# EAGLE design PAM8403 Amplifier Board R1 (EAGLE 9.6.2)
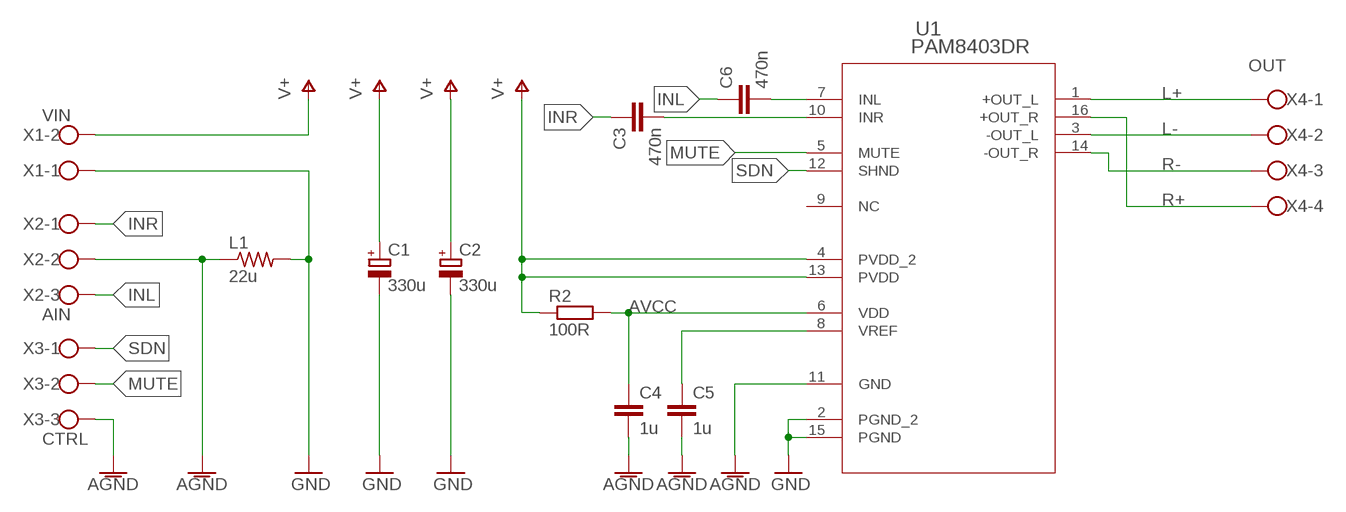
[diagram p0: schematic, sheet 1]

## Parts
C1  330u  CPOL-EUE3.5-8  [E3,5-8]
C2  330u  CPOL-EUE3.5-8  [E3,5-8]
C3  470n  C-EUC1206  [C1206]
C4  1u  C-EUC1206  [C1206]
C5  1u  C-EUC1206  [C1206]
C6  470n  C-EUC1206  [C1206]
L1  22u  R-US_R0805  [R0805]
R2  100R  R-EU_R0603  [R0603]
U1  PAM8403DR  [SOIC_8403DR_DIO]
X1  VIN  W237-102  [W237-102]
X2  AIN  W237-103  [W237-103]
X3  CTRL  W237-103  [W237-103]
X4  OUT  W237-4  [W237-4]

## Nets
AGND: C4.2 C5.2 L1.1 U1.11(GND) X2.2 X3.3
AVCC: C4.1 R2.2 U1.6(VDD)
GND: C1.- C2.- L1.2 U1.2(PGND_2) U1.15(PGND) X1.1
INL: C6.1 X2.3
INR: C3.1 X2.1
L+: U1.1(+OUT_L) X4.1
L-: U1.3(-OUT_L) X4.2
MUTE: U1.5(MUTE) X3.2
N$1: C3.2 U1.10(INR)
N$2: C6.2 U1.7(INL)
N$3: C5.1 U1.8(VREF)
R+: U1.16(+OUT_R) X4.4
R-: U1.14(-OUT_R) X4.3
SDN: U1.12(SHND) X3.1
V+: C1.+ C2.+ R2.1 U1.4(PVDD_2) U1.13(PVDD) X1.2
Unconnected: U1.9(NC)

## Library data of the parts
C1 C2 = rcl:CPOL-EU: POLARIZED CAPACITOR, European symbol; SPICEPREFIX: C
C3-C6 = rcl:C-EU: CAPACITOR, European symbol; SPICEPREFIX: C
L1 = rcl:R-US_: RESISTOR, American symbol; SPICEPREFIX: R
R2 = rcl:R-EU_: RESISTOR, European symbol; SPICEPREFIX: R
U1 = user:PAM8403DR; COPYRIGHT: Copyright (C) 2023 Ultra Librarian. All rights reserved.; MANUFACTURER_PART_NUMBER: PAM8403DR; MFR_NAME: Diodes Inc
X1 = con-wago-500:W237-102: WAGO SCREW CLAMP; MPN: 237-102; OC_FARNELL: unknown; OC_NEWARK: 70K9898
X2 X3 = con-wago-500:W237-103: WAGO SCREW CLAMP; MPN: 237-103; OC_FARNELL: unknown; OC_NEWARK: 18M7116
X4 = con-wago-500:W237-4: WAGO SCREW CLAMP; OC_FARNELL: unknown; OC_NEWARK: unknown

## Board
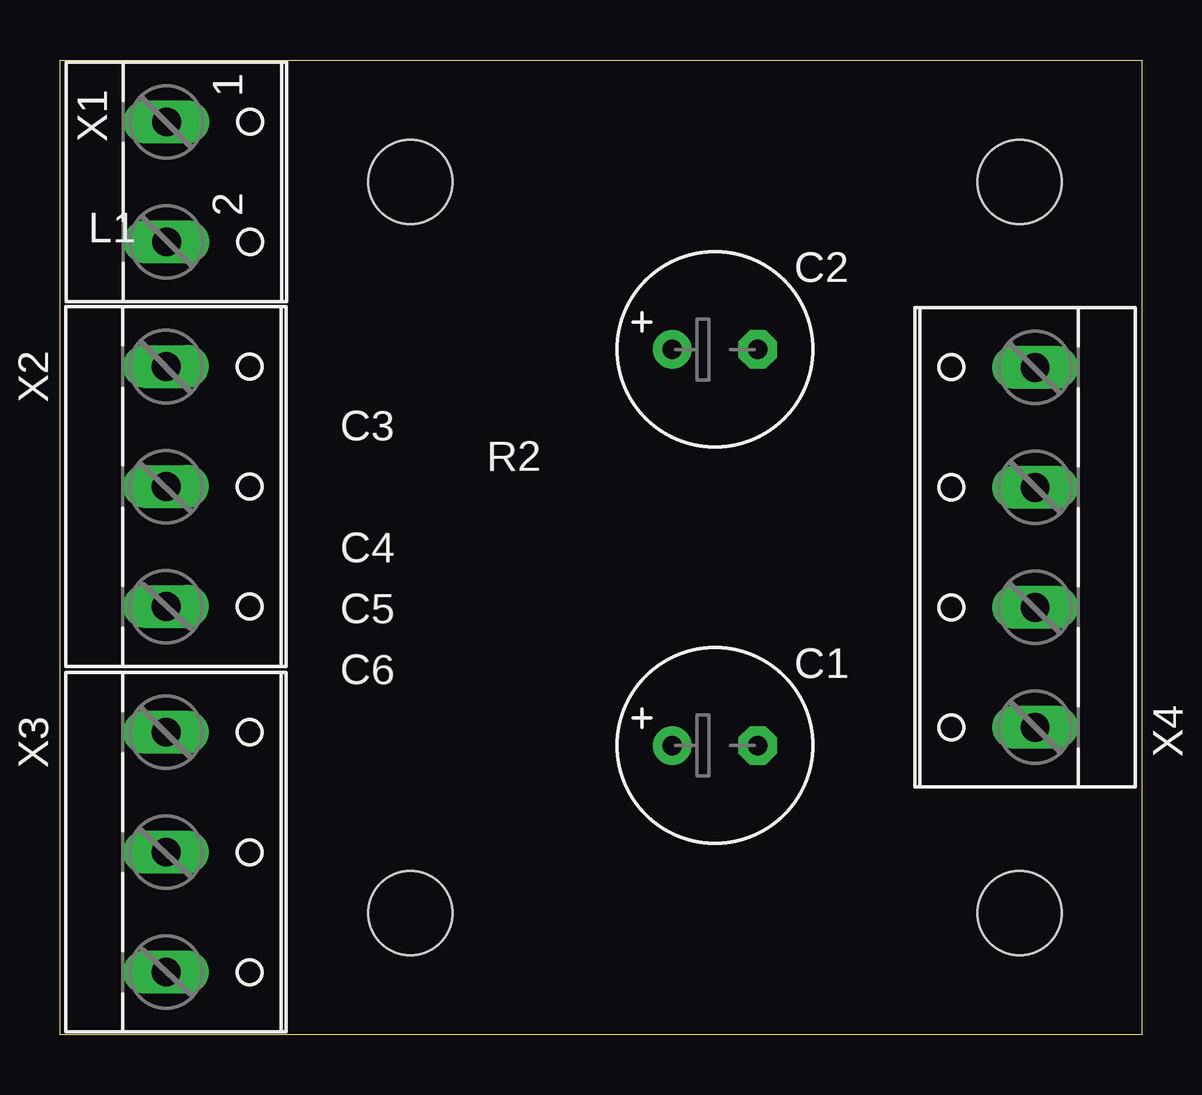
[diagram p1: board, top side]
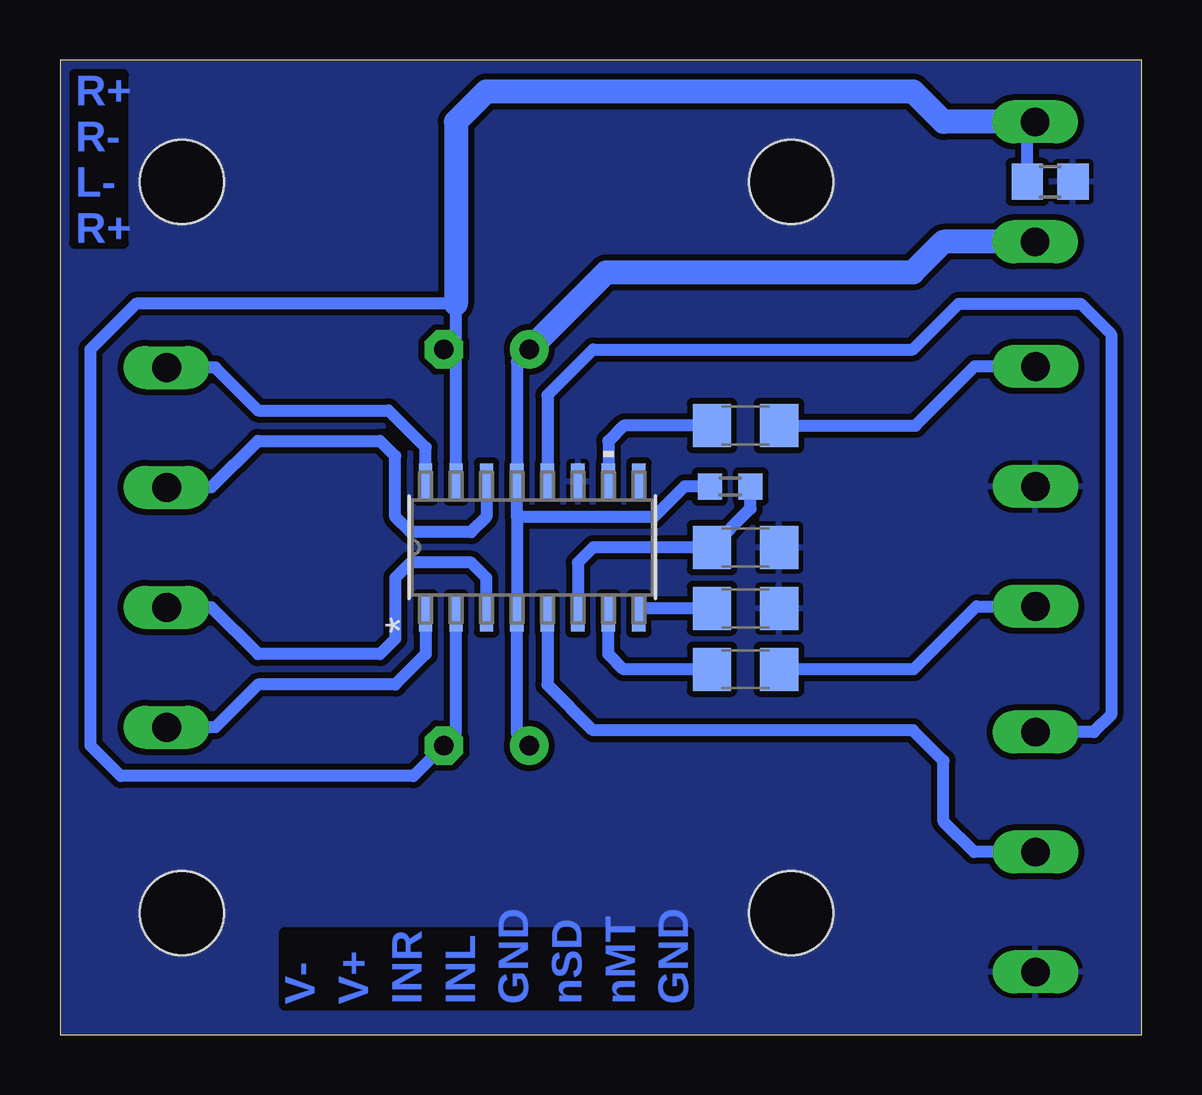
[diagram p2: board, bottom side, seen from below]

Size 45.09 x 40.64 mm. Coordinates in mm from the lower left corner, seen from the top.
Outline: 0,40.64 45.09,40.64 45.09,0 0,0 0,40.64
Copper layers (1*16): Top 0.035mm / dielectric 1.5mm / Bottom 0.035mm
Design rules "default *": minimum track width 0.15mm, minimum drill 0.35mm, track to track 0.25mm, track to pad 0.2mm, pad to pad 0.2mm, via to via 0.2mm, smd to smd 0.2mm, copper to edge 0.002540625mm, drill to drill 6mil, minimum pad ring 10mil, minimum via ring 8mil, stop-mask expansion 4mil, vias tented up to drill 0mil, thermal gap 0.2mm
Holes 3.5 mm at 14.61,5.08 14.61,35.56 40.01,35.56 40.01,5.08

### Footprints (pad centres in the part's own frame; a part is rotated, then mirrored left to right if it is on the bottom)
E3,5-8 = drill 0.813 pad 1.6: + -1.778,0 | drill 0.813 pad 1.6 octagon: - 1.778,0
C1206 = smd 1.6 x 1.8: 1 -1.4,0; 2 1.4,0
R0805 = smd 1.3 x 1.5: 1 -0.95,0; 2 0.95,0
R0603 = smd 1 x 1.1: 1 -0.85,0; 2 0.85,0
SOIC_8403DR_DIO = smd 1.511 x 0.559: 1 -2.75,4.445; 2 -2.75,3.175; 3 -2.75,1.905; 4 -2.75,0.635; 5 -2.75,-0.635; 6 -2.75,-1.905; 7 -2.75,-3.175; 8 -2.75,-4.445; 9 2.75,-4.445; 10 2.75,-3.175; 11 2.75,-1.905; 12 2.75,-0.635; 13 2.75,0.635; 14 2.75,1.905; 15 2.75,3.175; 16 2.75,4.445
W237-102 = drill 1.194 long: 1 -2.5,-1.27; 2 2.5,-1.27
W237-103 = drill 1.194 long: 1 -5,-1.29; 2 0,-1.29; 3 5,-1.29
W237-4 = drill 1.194 long: 1 -7.5,-1.27; 2 -2.5,-1.27; 3 2.5,-1.27; 4 7.5,-1.27

### Placement (x,y rotation side)
C1  27.3,12.06 0 top
C2  27.3,28.58 0 top
C3  16.51,25.4 180 bottom
C4  16.51,20.32 0 bottom
C5  16.51,17.78 0 bottom
C6  16.51,15.24 180 bottom
L1  3.81,35.56 180 bottom
R2  17.14,22.86 0 bottom
U1  25.4,20.32 90 bottom
X1  5.72,35.56 270 top
X2  5.72,22.86 270 top
X3  5.72,7.62 270 top
X4  39.37,20.32 90 top

### Tracks (layer width: path | path; a pad name or v marks a point on that pad's centre or on a via)
AGND
  pour Bottom: -0.63,41.27 45.72,41.27 45.72,-0.63 -0.63,-0.63
AVCC
  Bottom 0.5: U1.6 23.49,19.68 22.86,20.32 C4.1 16.29,21.93 R2.2
GND
  Bottom 0.5: U1.2 28.57,12.57 C1.- 30.35,10.79 42.55,10.79 43.82,12.06 43.82,28.58 41.91,30.48 28.57,30.48 28.57,29.08 C2.- 28.57,28.07 U1.15 | L1.2 4.76,37.75 X1.1
  Bottom 1: X1.1 8.25,38.06 9.52,39.33 27.3,39.33 28.57,38.06 28.57,30.48
INL
  Bottom 0.5: C6.1 9.5,15.24 6.89,17.86 X2.3
INR
  Bottom 0.5: C3.1 9.43,25.4 6.97,27.86 X2.1
L+
  Bottom 0.5: U1.1 29.85,15.88 31.11,14.61 36.83,14.61 38.62,12.82 X4.1
L-
  Bottom 0.5: U1.3 27.3,19.05 27.94,19.68 30.48,19.68 31.11,19.05 31.11,16.51 31.75,15.88 36.83,15.88 38.78,17.82 X4.2
MUTE
  Bottom 0.5: U1.5 24.76,14.61 22.86,12.7 9.52,12.7 8.25,11.43 8.25,8.89 6.99,7.62 X3.2
N$1
  Bottom 0.5: C3.2 21.59,25.4 22.22,24.77 U1.10
N$2
  Bottom 0.5: C6.2 21.59,15.24 22.22,15.88 U1.7
N$3
  Bottom 0.5: C5.1 20.74,17.78 U1.8
R+
  Bottom 0.5: U1.16 29.85,24.48 31.39,26.04 36.83,26.04 38.62,27.82 X4.4
R-
  Bottom 0.5: U1.14 27.3,21.59 27.94,20.96 30.48,20.96 31.11,21.59 31.11,24.13 31.75,24.77 36.83,24.77 38.78,22.82 X4.3
SDN
  Bottom 0.5: U1.12 24.76,26.67 22.86,28.58 9.52,28.58 7.62,30.48 2.54,30.48 1.27,29.21 1.27,13.34 1.99,12.62 X3.1
V+
  Bottom 0.5: R2.1 19.05,22.86 20.32,21.59 26.04,21.59 | 26.04,21.59 U1.13 26.04,28.07 C2.+ | 26.04,21.59 U1.4 26.04,12.57 C1.+
  Bottom 1: X1.2 8.25,33.06 9.52,31.79 22.31,31.79 C2.+

### Text on the board
Bottom: R+ / R- / L- / R+ | V- / V+ / INR / INL / GND / nSD / nMT / GND